# EasyEDA schematic 1-Schematic_rACK_MOOG_LADDER_FILTER_MAIN_BOARD.json
TITLE: rACK - MOOG Ladder Filter Main Board; REV: 1.0; Date: 2021-12-06; Sheet: 1/1; Drawn By: SherlockOhms2K; Company: SherlockOHMS Ω
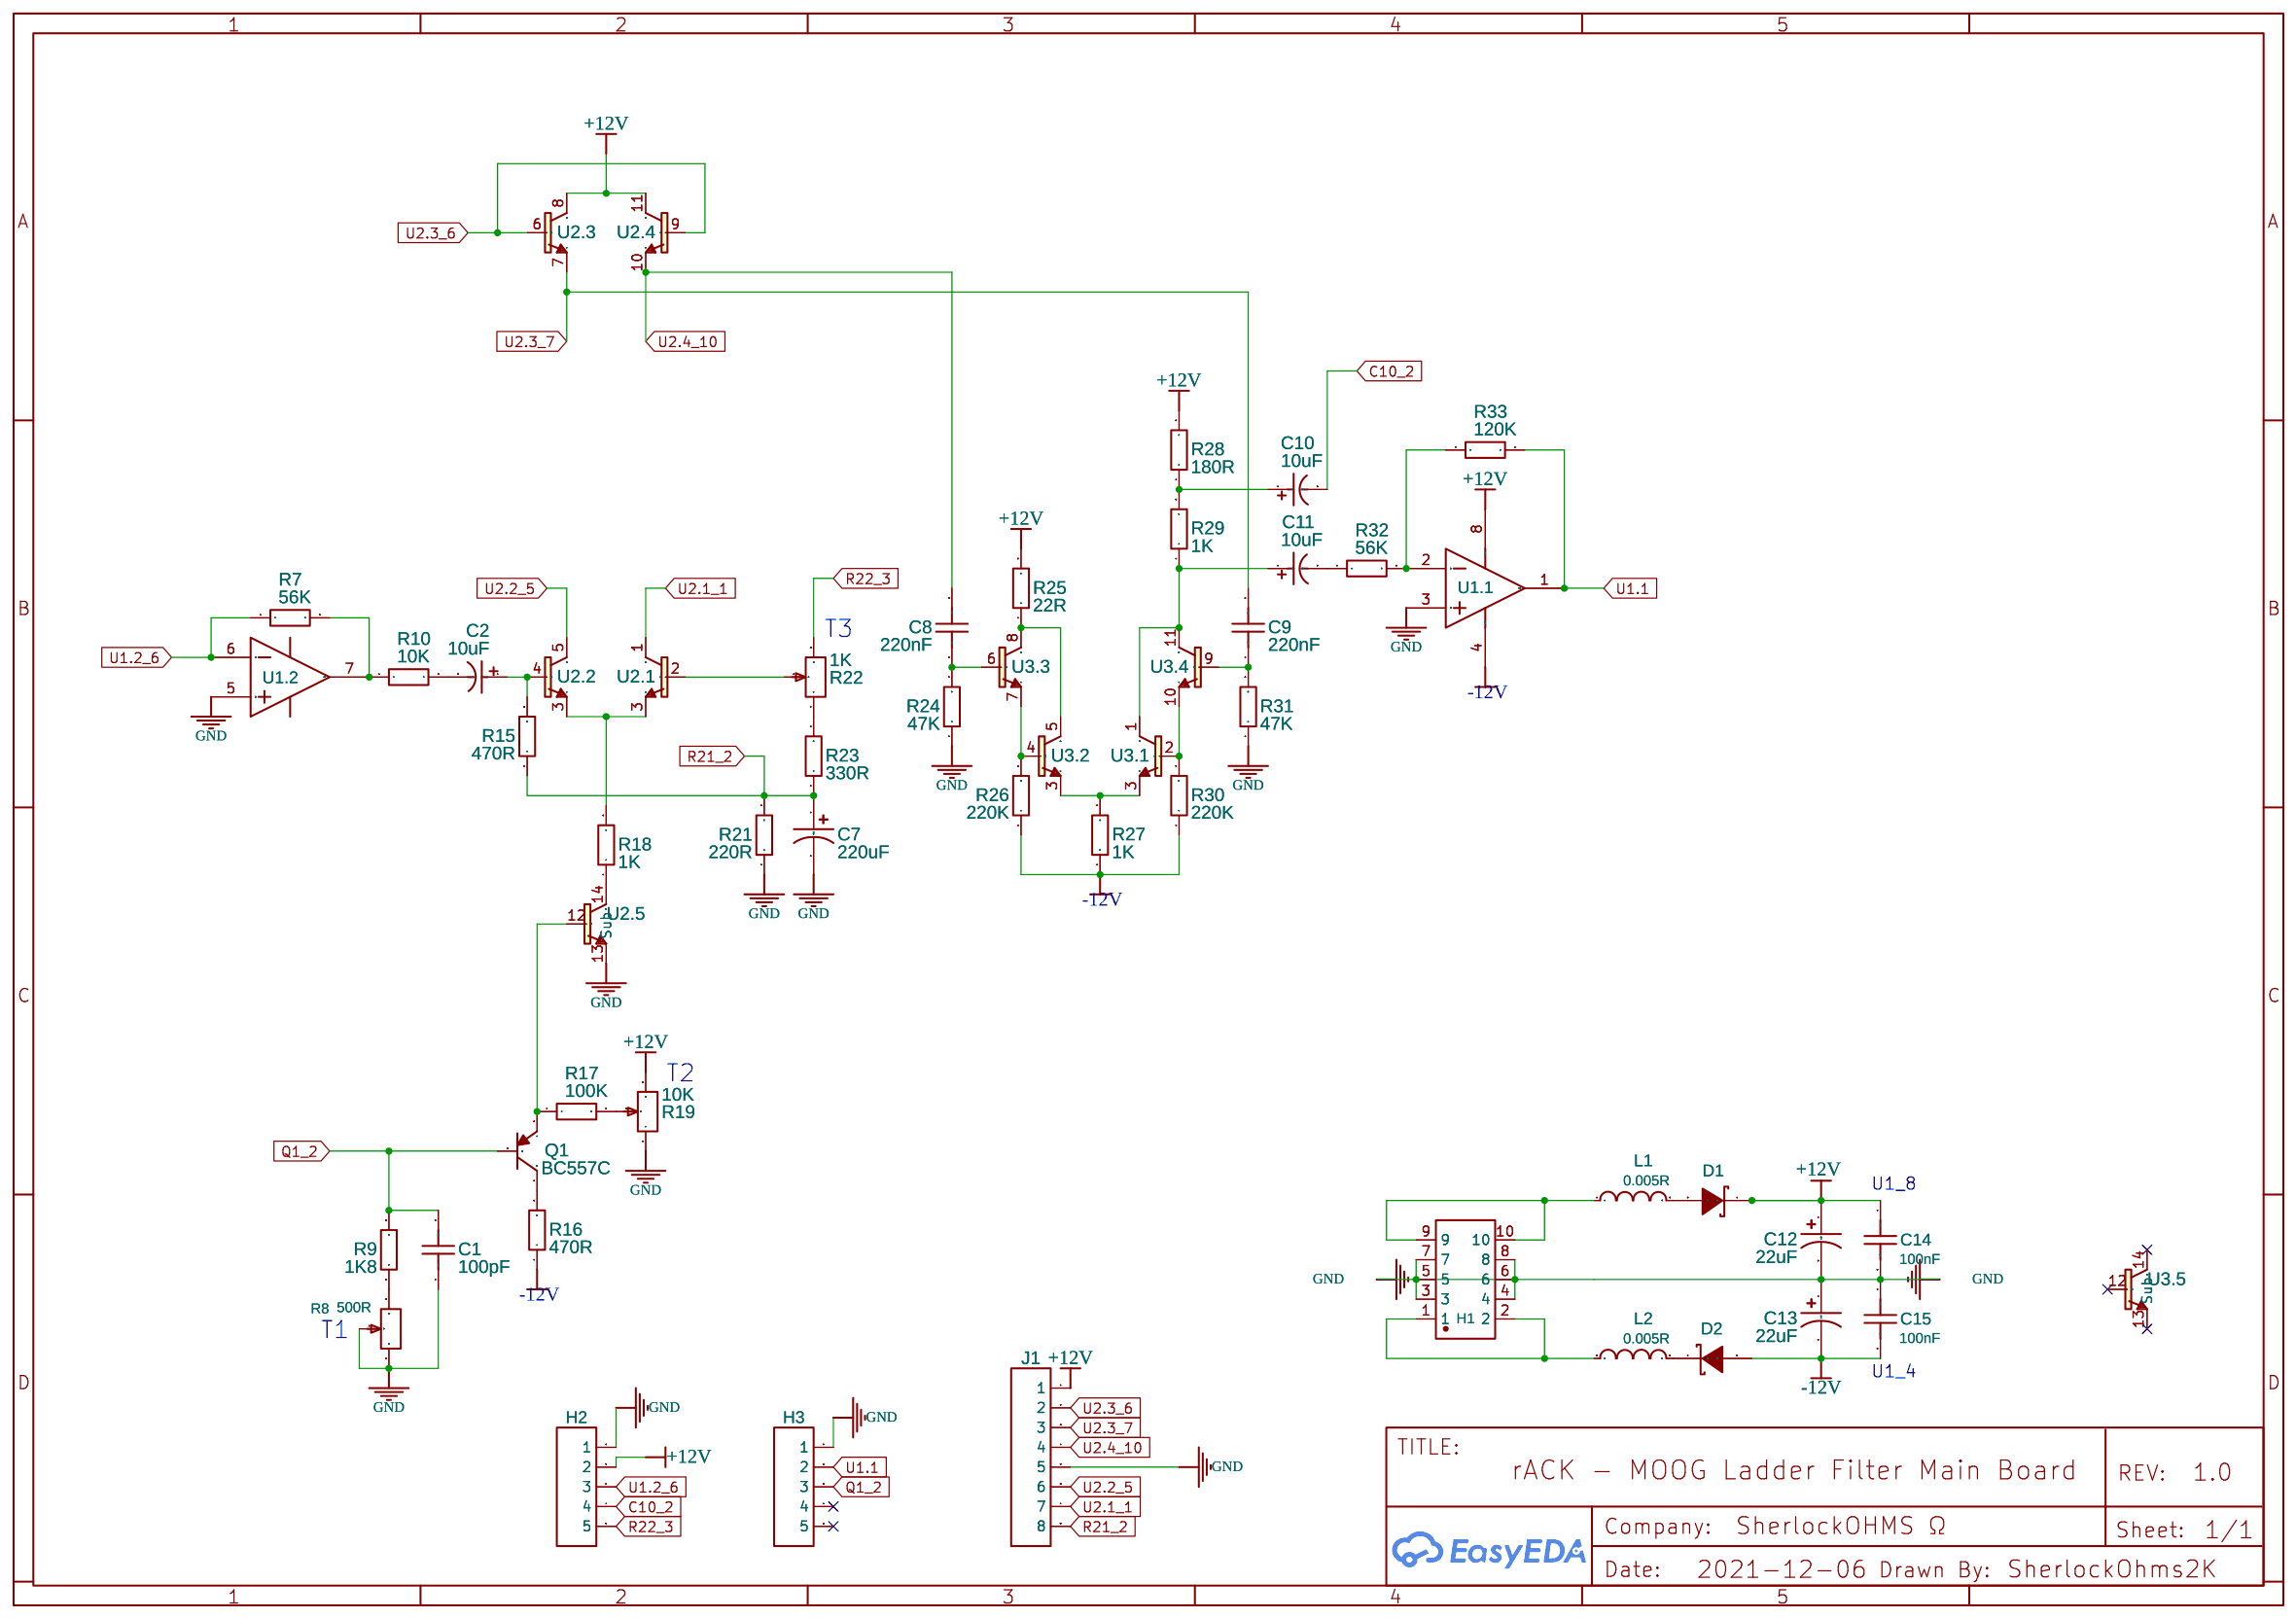
[diagram p0: schematic sheet]

## Parts
C1  100pF  [CAP-TH_L4.8-W3.2-P5.08-D0.5]
C2  10uF  [CAP-TH_BD5.0-P2.00-D0.8-FD]
C7  220uF  [CAP-D10.0×F5.0]
C8  220nF  [CAP-TH_L7.2-W3.5-P5.00-D0.5]
C9  220nF  [CAP-TH_L7.2-W3.5-P5.00-D0.5]
C10  10uF  [CAP-TH_BD5.0-P2.00-D0.8-FD]
C11  10uF  [CAP-TH_BD5.0-P2.00-D0.8-FD]
C12  22uF  [CAP-D6.3×F2.5]
C13  22uF  [CAP-D6.3×F2.5]
C14  100nF  [C1206]
C15  100nF  [C1206]
D1  CUS10S30,H3F  [SOD-323_L1.8-W1.3-LS2.5-RD]
D2  CUS10S30,H3F  [SOD-323_L1.8-W1.3-LS2.5-RD]
H1  321010SG0ABK00A01  [IDC-TH_10P-P2.54-V-R2-C5-S2.54]
H2  Header-Female-2.54_1x5  [HDR-TH_5P-P2.54-V]
H3  Header-Female-2.54_1x5  [HDR-TH_5P-P2.54-V]
J1  HDR-M-2.54_1x8  [HDR-M-2.54_1X8]
L1  0.005R  [L1206]
L2  0.005R  [L1206]
Q1  BC557C  [TO-92-3_L4.9-W3.7-P1.27-L]
R7  56K  [RES-TH_BD2.4-L6.3-P10.30-D0.6]
R8  500R  [RES-ADJ-TH_3296W]
R9  1K8  [RES-TH_BD2.2-L6.5-P10.50-D0.6]
R10  10K  [RES-TH_BD2.4-L6.3-P10.30-D0.6]
R15  470R  [RES-TH_BD2.4-L6.3-P10.30-D0.6]
R16  470R  [RES-TH_BD2.4-L6.3-P10.30-D0.6]
R17  100K  [RES-TH_BD2.2-L6.5-P10.50-D0.6]
R18  1K  [RES-TH_BD2.4-L6.3-P10.30-D0.6]
R19  10K  [RES-ADJ-TH_3296W]
R21  220R  [RES-TH_BD2.4-L6.3-P10.30-D0.6]
R22  1K  [RES-ADJ-TH_3296W]
R23  330R  [RES-TH_BD2.4-L6.3-P10.30-D0.6]
R24  47K  [RES-TH_BD2.4-L6.3-P10.30-D0.6]
R25  22R  [RES-TH_BD2.5-L6.5-P10.50-D0.6]
R26  220K  [RES-TH_BD2.4-L6.3-P10.30-D0.6]
R27  1K  [RES-TH_BD2.4-L6.3-P10.30-D0.6]
R28  180R  [RES-TH_BD2.4-L6.3-P10.30-D0.6]
R29  1K  [RES-TH_BD2.4-L6.3-P10.30-D0.6]
R30  220K  [RES-TH_BD2.4-L6.3-P10.30-D0.6]
R31  47K  [RES-TH_BD2.4-L6.3-P10.30-D0.6]
R32  56K  [RES-TH_BD2.4-L6.3-P10.30-D0.6]
R33  120K  [RES-TH_BD2.2-L6.5-P10.50-D0.6]
U1  TL072CP  [DIP-8_L9.4-W6.4-P2.54-LS9.1-BL]  (sections 1,2)
U2  AS3046  [DIP-14_SOCKET]  (sections 1,2,3,4,5)
U3  AS3046  [DIP-14_SOCKET]  (sections 1,2,3,4,5)

## Library data of the parts
C1 = CC4-0805-CG -50V-100pF-J: Supplier: LCSC; Supplier Part: C123146; Manufacturer: TORCH; Manufacturer Part: CC4-0805-CG-50V-100pF-J; Contributor: LCSC; JLCPCB Part Class: Extended Part
C2 C10 C11 = 10uF 50V 5*7: Supplier: LCSC; Manufacturer: ValuePro; Supplier Part: C45669; JLCPCB Part Class: Extended Part
C7 = CE_TH_D10.0×F5.0_US: Supplier Part: 493-15066-ND; Supplier: Digi-Key; Contributor: LCEDA_Lib; Manufacturer Part: UFG1E221MPM; Manufacturer: Nichicon
C8 C9 = PE224J2A0501: Supplier: LCSC; Supplier Part: C393118; Manufacturer: KYET; Contributor: LCSC; JLCPCB Part Class: Extended Part
C12 C13 = CE_TH_D6.3×F2.5_US: Supplier Part: 493-15074-ND; Supplier: Digi-Key; Contributor: LCEDA_Lib; Manufacturer Part: UFG1H220MEM; Manufacturer: Nichicon
C14 C15 = CC1206KRX7R9BB104: Supplier: LCSC; Manufacturer: YAGEO; Supplier Part: C82601
D1 D2 = CUS10S30,H3F: Supplier: LCSC; Manufacturer: TOSHIBA; Contributor: LCSC; Supplier Part: C146335; SMT Type: Extend; JLCPCB SMD: Yes; LCSC Assembly: Yes; Paste Type: expand
H1 = 321010SG0ABK00A01: Supplier: LCSC; Supplier Part: C429962; Manufacturer: JILN; Contributor: LCSC
H2 H3 = Header-Female-2.54_1x5: Supplier: LCSC; Manufacturer: BOOMELE; Manufacturer Part: 2.54mm 1*5p Female header; image: //image.lceda.cn/szlcsc/C50950.jpg; Supplier Part: C50950; LCSC Assembly: Yes; SMT Type: Extend; Paste Type: expand
J1 = HDR-M-2.54_1x8: Supplier Part: C190820; Supplier: LCSC; Manufacturer: Nextron; Manufacturer Part: Z-211-0811-0021-001; Contributor: LCEDA_Lib
L1 L2 = FBMJ3216HM380NT: Supplier: LCSC; Manufacturer: TAIYO YUDEN; Supplier Part: C92885
Q1 = BC557C: Supplier: LCSC; Supplier Part: C713618; Manufacturer: LGE; Contributor: LCSC; JLCPCB Part Class: Extended Part
R7 R32 = MFR-25FTE52-56K: Supplier: LCSC; Supplier Part: C173031; Manufacturer: YAGEO; Contributor: LCSC; JLCPCB Part Class: Extended Part
R8 = 3296W-1-501LF: Supplier: LCSC; Manufacturer: BOURNS; Supplier Part: C69564; Resistance(Ohms): 500
R9 = MFR-25JT-52-1K8: Supplier: LCSC; Supplier Part: C176468; Manufacturer: YAGEO; Contributor: LCSC; JLCPCB Part Class: Extended Part
R10 = MFR-25FTE52-10K: Supplier: LCSC; Supplier Part: C172967; Manufacturer: YAGEO; Contributor: LCSC; JLCPCB Part Class: Extended Part
R15 R16 = MFR-25FTE52-470R: Supplier: LCSC; Supplier Part: C173020; Manufacturer: YAGEO; Contributor: LCSC; JLCPCB Part Class: Extended Part
R17 = MFR-25FTE52-100K: Supplier: LCSC; Supplier Part: C172965; Manufacturer: YAGEO; Contributor: LCSC; JLCPCB Part Class: Extended Part
R18 R27 R29 = MFR-25FTE52-1K: Supplier: LCSC; Supplier Part: C172978; Manufacturer: YAGEO; Contributor: LCSC; JLCPCB Part Class: Extended Part
R19 = 3296W-1-103LF: Supplier: LCSC; Manufacturer: BOURNS; Supplier Part: C34846
R21 = MFR-25FTE52-220R: Supplier: LCSC; Supplier Part: C172985; Manufacturer: YAGEO; Contributor: LCSC; JLCPCB Part Class: Extended Part
R22 = 3296W-1-102LF: Supplier: LCSC; Manufacturer: BOURNS; Supplier Part: C57089; JLCPCB Part Class: Extended Part
R23 = MFR-25JT-52-330R: Supplier: LCSC; Supplier Part: C176501; Manufacturer: YAGEO; Contributor: LCSC; JLCPCB Part Class: Extended Part
R24 R31 = MFR-25FTE52-47K: Supplier: LCSC; Supplier Part: C173021; Manufacturer: YAGEO; Contributor: LCSC; JLCPCB Part Class: Extended Part
R25 = MFR0W4F220JA50: Supplier: LCSC; Manufacturer: UniOhm; Supplier Part: C58611; JLCPCB Part Class: Extended Part
R26 R30 = MFR-25FTE52-220K: Supplier: LCSC; Supplier Part: C172984; Manufacturer: YAGEO; Contributor: LCSC; JLCPCB Part Class: Extended Part
R28 = MFR-25FTE52-180R: Supplier: LCSC; Supplier Part: C172976; Manufacturer: YAGEO; Contributor: LCSC; JLCPCB Part Class: Extended Part
R33 = MFR-25FTE52-120K: Supplier: LCSC; Supplier Part: C172968; Manufacturer: YAGEO; Contributor: LCSC; JLCPCB Part Class: Extended Part
U1 = TL072CP: tags: FET Operational Amplifier; Supplier Part: C7236; Supplier: LCSC; Manufacturer: TI; subpart_no: 1; image: http://image.lceda.cn/szlcsc/C7236.jpg
U2 = CA3046: Contributor: SparkFun; subpart_no: 1; Supplier: cabintech Global; Supplier Part: AS3046-DIL; Manufacturer: ALPHA RPAR
U3 = CA3046: Contributor: SparkFun; subpart_no: 1; Supplier Part: AS3046-DIL; Manufacturer: ALPHA RPAR; Supplier: cabintech Global

## Nets
+12V: C12.1 C14.1 D1.1(K) H2.2 J1.1 R19.3 R25.2 R28.2 U1.8(VCC+) U2.8(C) U2.11(C)
-12V: C13.2 C15.2 D2.2(A) R16.1 R26.1 R27.1 R30.1 U1.4(VCC-)
GND: C1.1 C7.2 C12.2 C13.1 C14.2 C15.1 H1.3 H1.4 H1.5 H1.6 H1.7 H1.8 H2.1 H3.1 J1.5 R8.1 R8.2 R19.1 R21.1 R24.1 R31.1 U1.3(IN1+) U1.5(IN2+) U2.13(Sub)
C10_2: C10.2 H2.4
Q1_2: C1.2 H3.3 Q1.2(B) R9.2
R21_2: C7.1 J1.8 R15.1 R21.2 R23.1
R22_3: H2.5 R22.3
U1.1: H3.2 R33.2 U1.1(OUT1)
U1.2_6: H2.3 R7.1 U1.6(IN2-)
U2.1_1: J1.7 U2.1(C)
U2.2_5: J1.6 U2.5(C)
U2.3_6: J1.2 U2.6(B) U2.9(B)
U2.3_7: C9.2 J1.3 U2.7(E)
U2.4_10: C8.2 J1.4 U2.10(E)
Net-(C2-1): C2.1 R15.2 U2.4(B)
Net-(C2-2): C2.2 R10.2
Net-(C8-1): C8.1 R24.2 U3.6(B)
Net-(C9-1): C9.1 R31.2 U3.9(B)
Net-(C10-1): C10.1 R28.1 R29.2
Net-(C11-1): C11.1 R29.1 U3.1(C) U3.11(C)
Net-(C11-2): C11.2 R32.1
Net-(D1-2): D1.2(A) L1.2
Net-(D2-1): D2.1(K) L2.2
Net-(H1-1): H1.1 H1.2 L2.1
Net-(H1-9): H1.9 H1.10 L1.1
Net-(Q1-1): Q1.1(C) R16.2
Net-(Q1-3): Q1.3(E) R17.1 U2.12(B)
Net-(R7-2): R7.2 R10.1 U1.7(OUT2)
Net-(R8-3): R8.3 R9.1
Net-(R17-2): R17.2 R19.2
Net-(R18-1): R18.1 U2.14(C)
Net-(R18-2): R18.2 U2.3(E)
Net-(R22-1): R22.1 R23.2
Net-(R22-2): R22.2 U2.2(B)
Net-(R25-1): R25.1 U3.5(C) U3.8(C)
Net-(R26-2): R26.2 U3.4(B) U3.7(E)
Net-(R27-2): R27.2 U3.3(E)
Net-(R30-2): R30.2 U3.2(B) U3.10(E)
Net-(R32-2): R32.2 R33.1 U1.2(IN1-)

Not connected (* = marked no-connect by the designer): H3 4* 5*; U3 12(B)* 13(Sub)* 14(C)*

## Notes on the sheet
- T3
- T2
- U1_8
- T1
- U1_4
